# EAGLE schematic CSv2.1_exp_board (EAGLE 9.6.2)
COMPANY: ADAFRUIT INDUSTRIES; DRAWN: KTOWN; REV: B

## Sheet 1 of 2
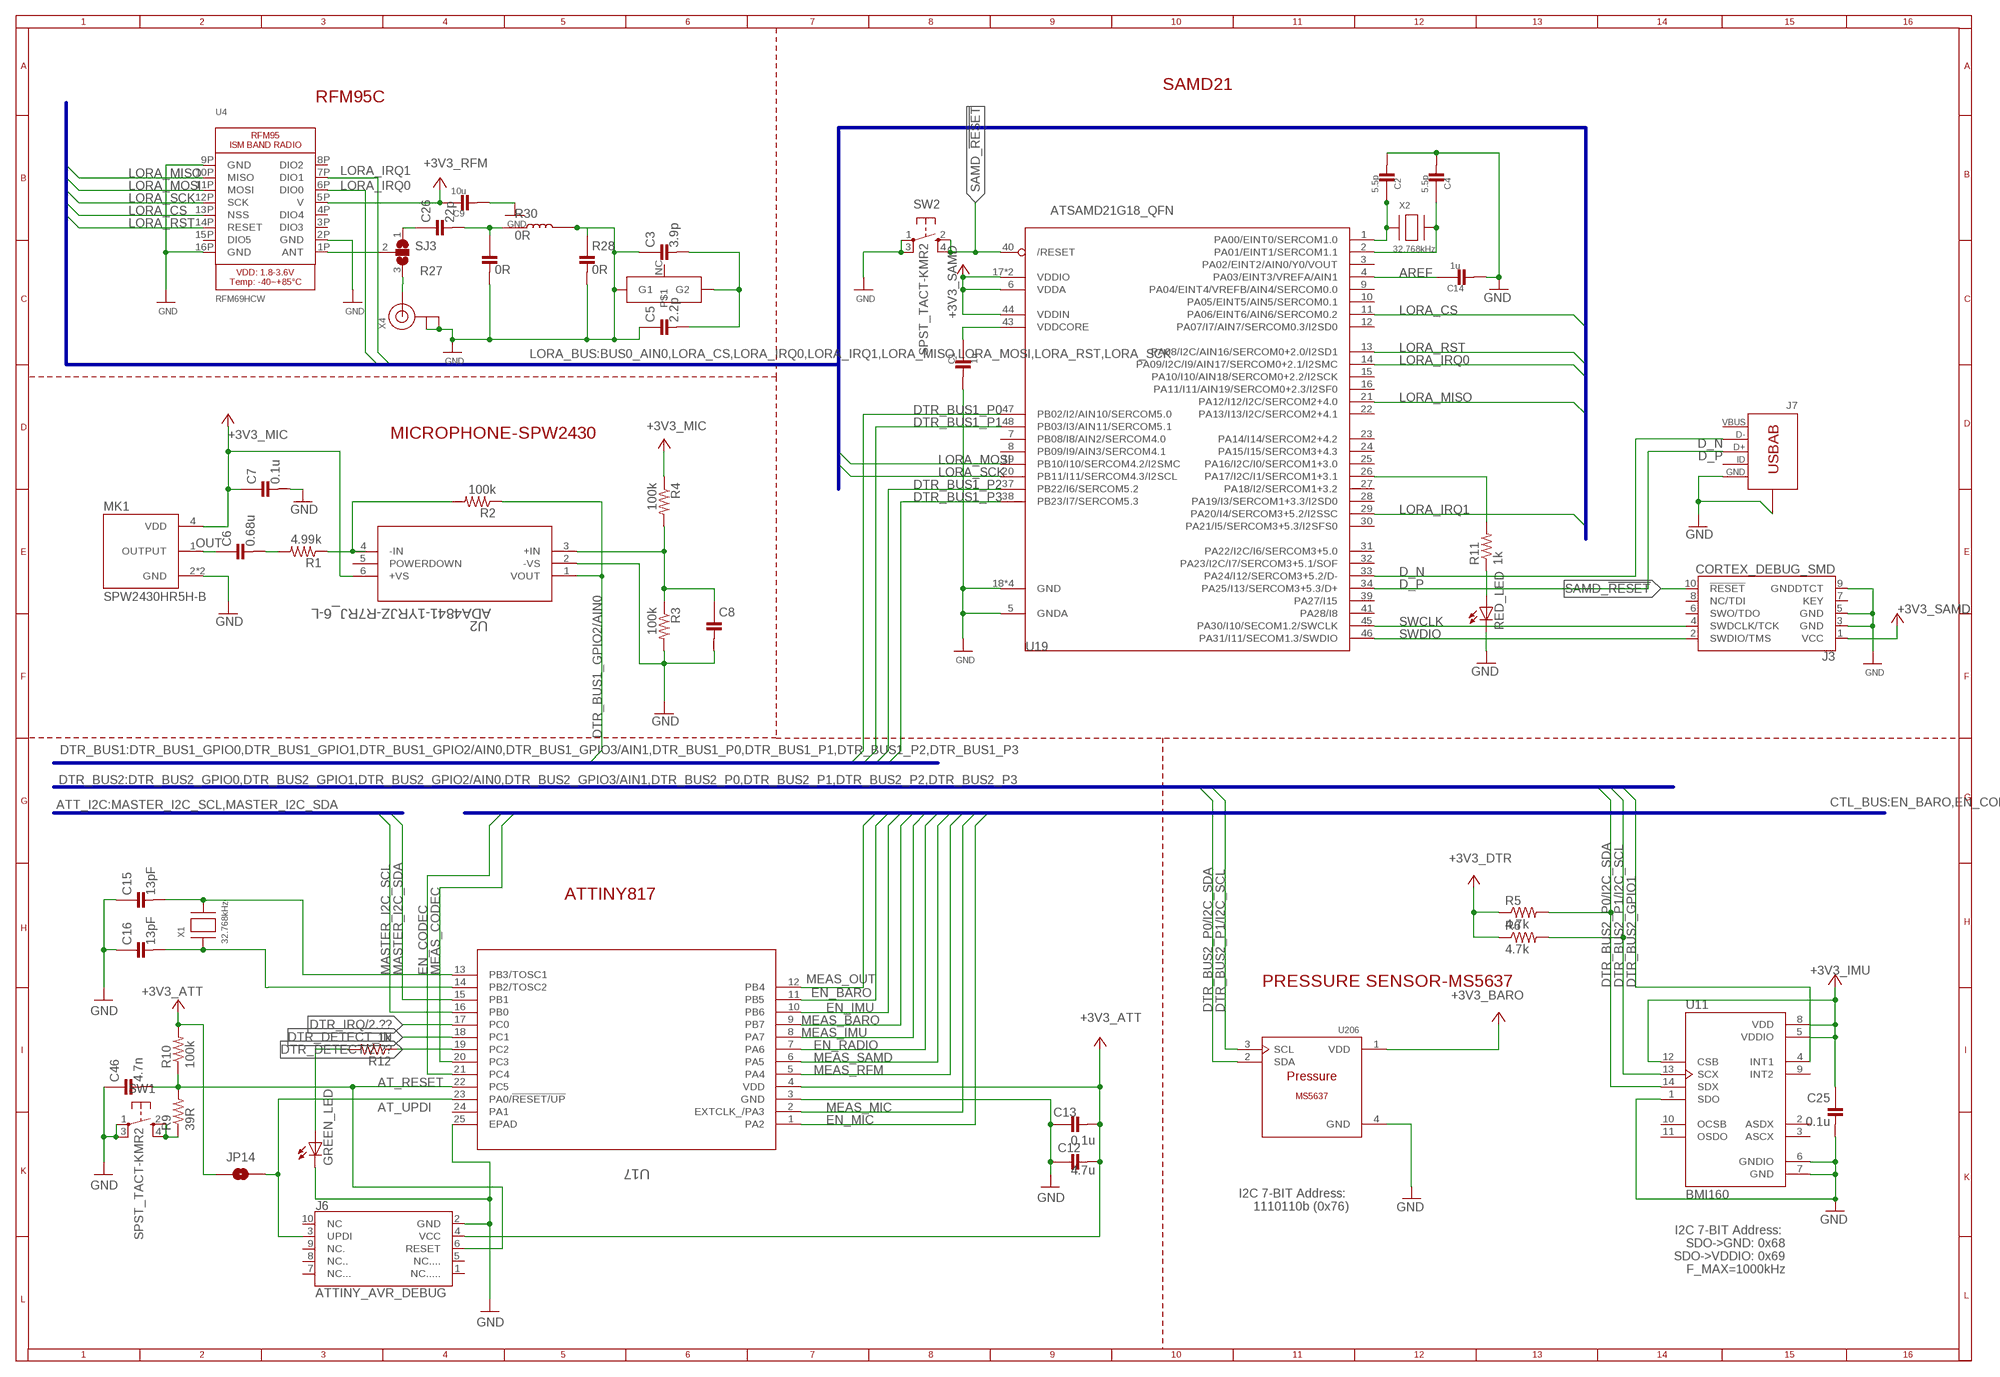
[diagram p0: schematic, sheet 1, part 1 of 2]
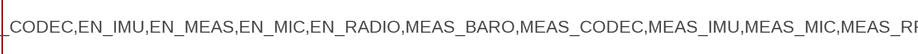
[diagram p1: schematic, sheet 1, part 2 of 2]

### Parts
A1  ILA09_CHIP_ANTENNA  [ILA_09_CHIP_ANTENNA]
C1  1u  C-0402  [C0402]
C2  5.5p  C-0402  [C0402]
C3  3.9p  C0402-ANT0402  [C0402-S]
C4  5.5p  C-0402  [C0402]
C5  2.2p  C0402-ANT0402  [C0402-S]
C6  0.68u  C-0402  [C0402]
C7  0.1u  C-0402  [C0402]
C8  1u  C-0402  [C0402]
C9  10u  C-0603  [C0603]
C12  4.7u  C-0603  [C0603]
C13  0.1u  C-0402  [C0402]
C14  1u  C-0402  [C0402]
C15  13pF  C-0402  [C0402]
C16  13pF  C-0402  [C0402]
C25  0.1u  C-0402  [C0402]
C26  22p  C0402-ANT0402  [C0402-S]
C46  4.7n  C-0402  [C0402]
GREEN_LED  LEDCHIPLED_0603  [CHIPLED_0603]
J3  CORTEX_DEBUG_SMD  [SAMTECH_FTSH-105-01]
J6  ATTINY_AVR_DEBUG  [SAMTECH_FTSH-105-01]
J7  J-USB-HIROSE-MICRO-USB  [USB-THRU-ZX62D-AB-5P8]
JP14  JUMPER-SMT_2_NO_PASTEFREE  [SMT-JUMPER_2_NO_PASTEFREE_NO-SILK]
MK1  SPW2430HR5H-B  [MIC_SPW2430HR5H-B]
R1  4.99k  R-0402  [R0402]
R2  100k  R-0402  [R0402]
R3  100k  R-0402  [R0402]
R4  100k  R-0402  [R0402]
R5  4.7k  R-0402  [R0402]
R6  4.7k  R-0402  [R0402]
R9  39R  R-0402  [R0402]
R10  100k  R-0402  [R0402]
R11  1k  R-0402  [R0402]
R12  1k  R-0402  [R0402]
R27  0R  C0402-ANT0402  [C0402-S]
R28  0R  C0402-ANT0402  [C0402-S]
R30  0R  L0402  [L0402]
RED_LED  LEDCHIPLED_0603  [CHIPLED_0603]
SJ3  JUMPER_SJ2W  [JUMPER_SJ_2]
SW1  SPST_TACT-KMR2  [KMR2]
SW2  SPST_TACT-KMR2  [KMR2]
U2  ADA4841-1YRJZ-R7RJ_6-L  [RJ_6-L]
U4  RFM69HCW  RFM95C  [RFM-MOD]
U11  BMI160  [PQFN50P300X250X88-14N]
U17  ATTINY817-MFRQFN24_RX4MC-L_ATTINY817-MFR  [ATTINY817-MFRQFN24_RX4MC-L_QFN24_4X4MC]
U19  ATSAMD21G18_QFN  MICROBUILDER_ATSAMD21J_QFN  [MICROBUILDER_TQFN48_7MM]
U206  MS5637  [MS5637]
X1  32.768kHz  ADAFRUIT2_XTAL-3.2X1.5  [ADAFRUIT2_XTAL3215]
X2  32.768kHz  ADAFRUIT2_XTAL-3.2X1.5  [ADAFRUIT2_XTAL3215]
X4  uFL  J-U.FL  [U.FL]

### Nets
+3V3_ATT [power]: C12.2 C13.2 J6.4(VCC) JP14.1 R10.2 U17.4(VDD) ; supply symbol labelled +3V3 ; also sheet 2
+3V3_BARO [power]: U206.1(VDD) ; supply symbol labelled +3V3 ; also sheet 2
+3V3_DTR [power]: R5.1 R6.1 ; supply symbol labelled +3V3 ; also sheet 2
+3V3_IMU [power]: C25.1 U11.5(VDDIO) U11.8(VDD) U11.12(CSB) ; supply symbol labelled +3V3 ; also sheet 2
+3V3_MIC [power]: C7.1 MK1.4(VDD) R4.1 U2.6(+VS) ; supply symbol labelled +3V3 ; also sheet 2
+3V3_RFM [power]: C9.1 U4.5P(V) ; supply symbol labelled +3V3 ; also sheet 2
+3V3_SAMD [power]: J3.1(VCC) U19.6(VDDA) U19.17(VDDIO) U19.36(VDDIO) U19.44(VDDIN) ; supply symbol labelled +3V3 ; also sheet 2
AREF: C14.1 U19.4(PA03/EINT3/VREFA/AIN1)
AT_RESET: C46.2 J6.6(RESET) R9.2 R10.1 U17.22(PC5)
AT_UPDI: J6.3(UPDI) JP14.2 U17.23(PA0/!RESET/UP)
D_N [diff_pair]: J7.D- U19.33(PA24/I12/SERCOM3+5.2/D-)
D_P [diff_pair]: J7.D+ U19.34(PA25/I13/SERCOM3+5.3/D+)
DTR_BUS1_GPIO2/AIN0: R2.1 U2.1(VOUT) ; also sheet 2
DTR_BUS1_P0: U19.47(PB02/I2/AIN10/SERCOM5.0) ; also sheet 2
DTR_BUS1_P1: U19.48(PB03/I3/AIN11/SERCOM5.1) ; also sheet 2
DTR_BUS1_P2: U19.37(PB22/I6/SERCOM5.2) ; also sheet 2
DTR_BUS1_P3: U19.38(PB23/I7/SERCOM5.3) ; also sheet 2
DTR_BUS2_GPIO1: U11.4(INT1) ; also sheet 2
DTR_BUS2_P0/I2C_SDA: R5.2 U11.14(SDX) U206.2(SDA) ; also sheet 2
DTR_BUS2_P1/I2C_SCL: R6.2 U11.13(SCX) U206.3(SCL) ; also sheet 2
DTR_DETECT: R12.1 U17.19(PC2) ; also sheet 2
DTR_DETECT_IN: U17.18(PC1)
DTR_DETECT_LED: GREEN_LED.A R12.2
DTR_IRQ: U17.17(PC0) ; also sheet 2
EN_BARO: U17.11(PB5) ; also sheet 2
EN_CODEC: U17.21(PC4) ; also sheet 2
EN_IMU: U17.10(PB6) ; also sheet 2
EN_MIC: U17.1(PA2) ; also sheet 2
EN_RADIO: U17.7(PA6) ; also sheet 2
GND: A1.G1 C1.2 C2.2 C3.1 C4.2 C5.1 C7.2 C8.2 C9.2 C12.1 C13.1 C14.2 C15.1 C16.1 C25.2 C46.1 GREEN_LED.C J3.3(GND) J3.5(GND) J3.9(GNDDTCT) J6.2(GND) J7.GND J7.S1(SHIELD) J7.S2(SHIELD) J7.S3(SHIELD) J7.S4(SHIELD) MK1.2(GND) MK1.3(GND) R3.2 R27.2 R28.1 R28.2 R30.2 RED_LED.C SW1.1(P) SW1.3(P1) SW2.1(P) SW2.3(P1) U2.2(-VS) U4.2P(GND) U4.9P(GND) U4.16P(GND) U11.1(SDO) U11.6(GNDIO) U11.7(GND) U17.3(GND) U17.25(EPAD) U19.5(GNDA) U19.18(GND) U19.35(GND) U19.42(GND) U19.THERMAL(GND) U206.4(GND) X4.1(GND) X4.2(GND) ; also sheet 2
IN-: R1.1 R2.2 U2.4(-IN)
LORA_CS: U4.13P(NSS) U19.11(PA06/EINT6/AIN6/SERCOM0.2)
LORA_IRQ0: U4.6P(DIO0) U19.14(PA09/I2C/I9/AIN17/SERCOM0+2.1/I2SMC)
LORA_IRQ1: U4.7P(DIO1) U19.29(PA20/I4/SERCOM3+5.2/I2SSC)
LORA_MISO: U4.10P(MISO) U19.21(PA12/I12/I2C/SERCOM2+4.0)
LORA_MOSI: U4.11P(MOSI) U19.19(PB10/I10/SERCOM4.2/I2SMC)
LORA_RST: U4.14P(RESET) U19.13(PA08/I2C/AIN16/SERCOM0+2.0/I2SD1)
LORA_SCK: U4.12P(SCK) U19.20(PB11/I11/SERCOM4.3/I2SCL)
MASTER_I2C_SCL: U17.16(PB0) ; also sheet 2
MASTER_I2C_SDA: U17.15(PB1) ; also sheet 2
MEAS_BARO: U17.9(PB7) ; also sheet 2
MEAS_CODEC: U17.20(PC3) ; also sheet 2
MEAS_IMU: U17.8(PA7) ; also sheet 2
MEAS_MIC: U17.2(EXTCLK_/PA3) ; also sheet 2
MEAS_OUT: U17.12(PB4) ; also sheet 2
MEAS_RFM: U17.5(PA4) ; also sheet 2
MEAS_SAMD: U17.6(PA5) ; also sheet 2
N$1: C1.1 U19.43(VDDCORE)
N$2: SJ3.3 X4.3(SIGNAL)
N$3: C8.1 R3.1 R4.2 U2.3(+IN)
N$4: A1.G2 C3.2 C5.2
N$5: C2.1 U19.1(PA00/EINT0/SERCOM1.0) X2.P$1
N$6: C6.2 R1.2
N$7: C4.1 U19.2(PA01/EINT1/SERCOM1.1) X2.P$2
N$9: C26.1 SJ3.1
N$12: R9.1 SW1.2(S) SW1.4(S1)
N$13: C26.2 R27.1 R30.1
N$19: R11.2 U19.26(PA17/I2C/I1/SERCOM1+3.1)
N$20: R11.1 RED_LED.A
N$22: C16.2 U17.14(PB2/TOSC2) X1.P$1
N$23: C15.2 U17.13(PB3/TOSC1) X1.P$2
N$26: SJ3.2 U4.1P(ANT)
OUT: C6.1 MK1.1(OUTPUT)
SAMD_!RESET: J3.10(!RESET) SW2.2(S) SW2.4(S1) U19.40(/RESET)
SWCLK: J3.4(SWDCLK/TCK) U19.45(PA30/I10/SECOM1.2/SWCLK)
SWDIO: J3.2(SWDIO/TMS) U19.46(PA31/I11/SECOM1.3/SWDIO)
Unconnected: A1.NC J3.6(SWO/TDO) J3.7(KEY) J3.8(NC/TDI) J6.1(NC.....) J6.5(NC....) J6.7(NC...) J6.8(NC..) J6.9(NC.) J6.10(NC) J7.USBID J7.VBUS U4.3P(DIO3) U4.4P(DIO4) U4.8P(DIO2) U4.15P(DIO5) U11.2(ASDX) U11.3(ASCX) U11.9(INT2) U11.10(OCSB) U11.11(OSDO) U17.24(PA1) U19.3(PA02/EINT2/AIN0/Y0/VOUT) U19.7(PB08/I8/AIN2/SERCOM4.0) U19.8(PB09/I9/AIN3/SERCOM4.1) U19.9(PA04/EINT4/VREFB/AIN4/SERCOM0.0) U19.10(PA05/EINT5/AIN5/SERCOM0.1) U19.12(PA07/I7/AIN7/SERCOM0.3/I2SD0) U19.15(PA10/I10/AIN18/SERCOM0+2.2/I2SCK) U19.16(PA11/I11/AIN19/SERCOM0+2.3/I2SF0) U19.22(PA13/I13/I2C/SERCOM2+4.1) U19.23(PA14/I14/SERCOM2+4.2) U19.24(PA15/I15/SERCOM3+4.3) U19.25(PA16/I2C/I0/SERCOM1+3.0) U19.27(PA18/I2/SERCOM1+3.2) U19.28(PA19/I3/SERCOM1+3.3/I2SD0) U19.30(PA21/I5/SERCOM3+5.3/I2SFS0) U19.31(PA22/I2C/I6/SERCOM3+5.0) U19.32(PA23/I2C/I7/SERCOM3+5.1/SOF) U19.39(PA27/I15) U19.41(PA28/I8)

### Buses
LORA_BUS:BUS0_AIN0,LORA_CS,LORA_IRQ0,LORA_IRQ1,LORA_MISO,LORA_MOSI,LORA_RST,LORA_SCK
ATT_I2C:MASTER_I2C_SCL,MASTER_I2C_SDA
CTL_BUS:EN_BARO,EN_CODEC,EN_IMU,EN_MEAS,EN_MIC,EN_RADIO,MEAS_BARO,MEAS_CODEC,MEAS_IMU,MEAS_MIC,MEAS_RFM,MEAS_SAMD
DTR_BUS1:DTR_BUS1_GPIO0,DTR_BUS1_GPIO1,DTR_BUS1_GPIO2/AIN0,DTR_BUS1_GPIO3/AIN1,DTR_BUS1_P0,DTR_BUS1_P1,DTR_BUS1_P2,DTR_BUS1_P3
DTR_BUS2:DTR_BUS2_GPIO0,DTR_BUS2_GPIO1,DTR_BUS2_GPIO2/AIN0,DTR_BUS2_GPIO3/AIN1,DTR_BUS2_P0,DTR_BUS2_P1,DTR_BUS2_P2,DTR_BUS2_P3

### Notes on the sheet
- SAMD21
- RFM95C
- MICROPHONE-SPW2430
- ATTINY817
- PRESSURE SENSOR-MS5637
- I2C 7-BIT Address: 
  1110110b (0x76)
- I2C 7-BIT Address: 
  SDO->GND: 0x68
  SDO->VDDIO: 0x69
  F_MAX=1000kHz

## Sheet 2 of 2
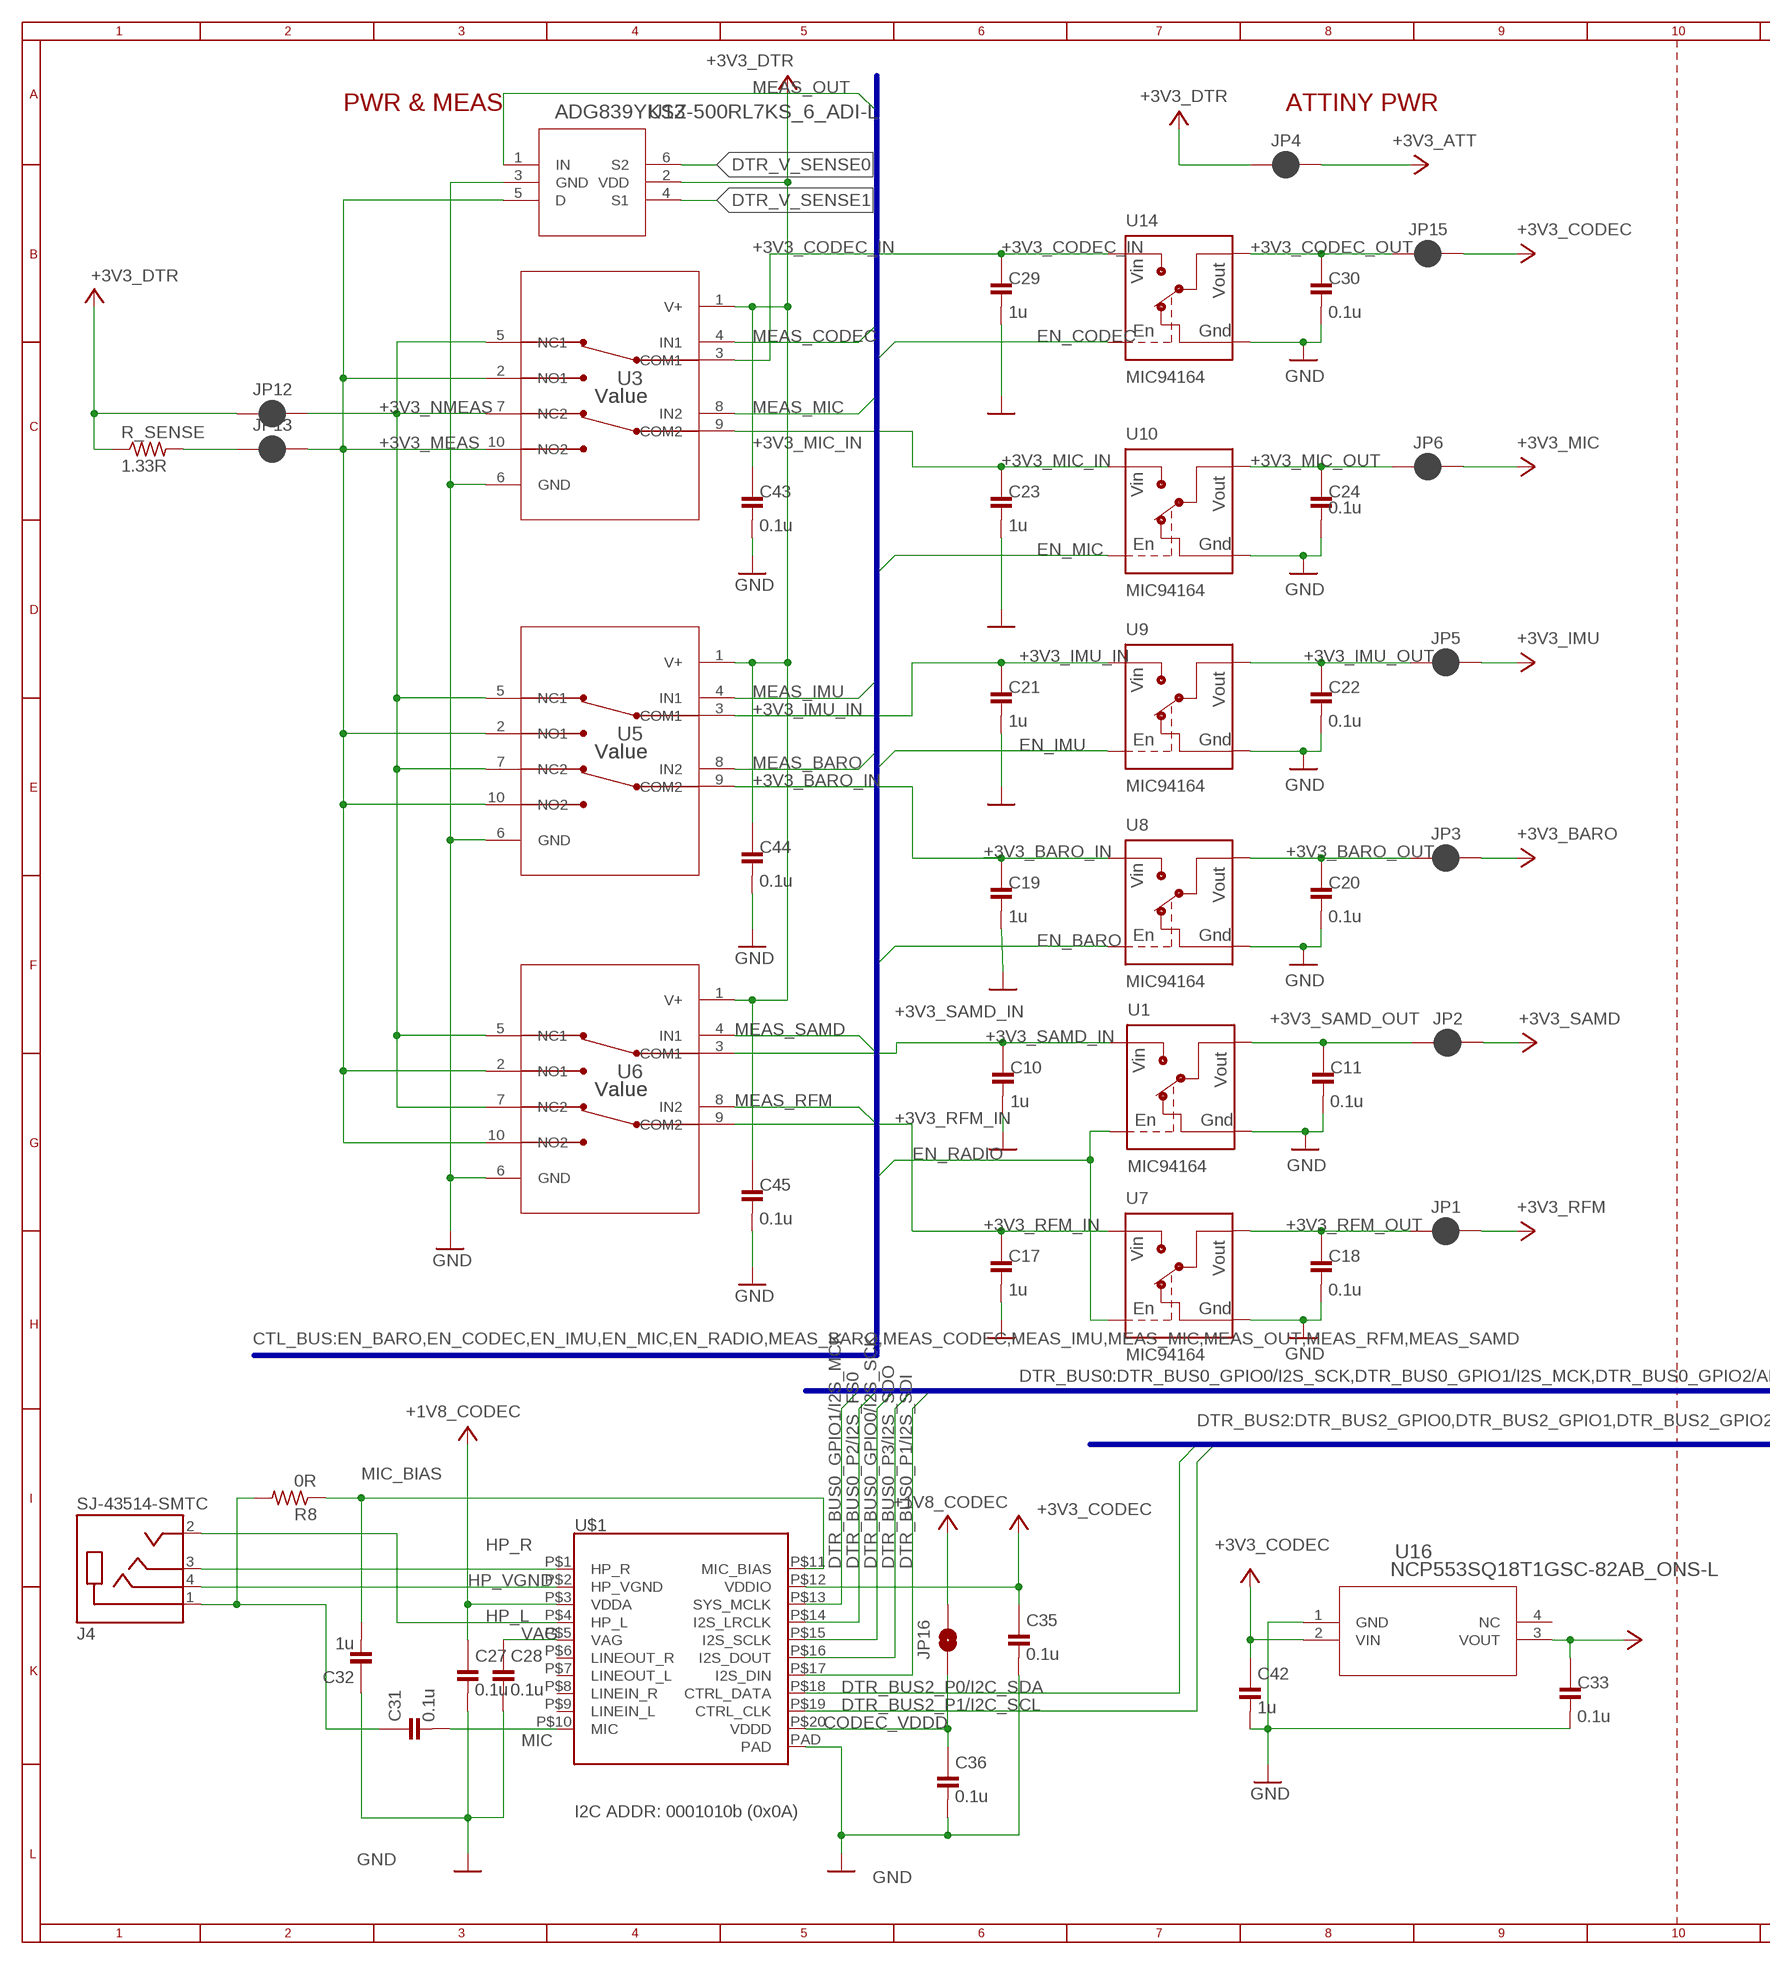
[diagram p2: schematic, sheet 2, part 1 of 2]
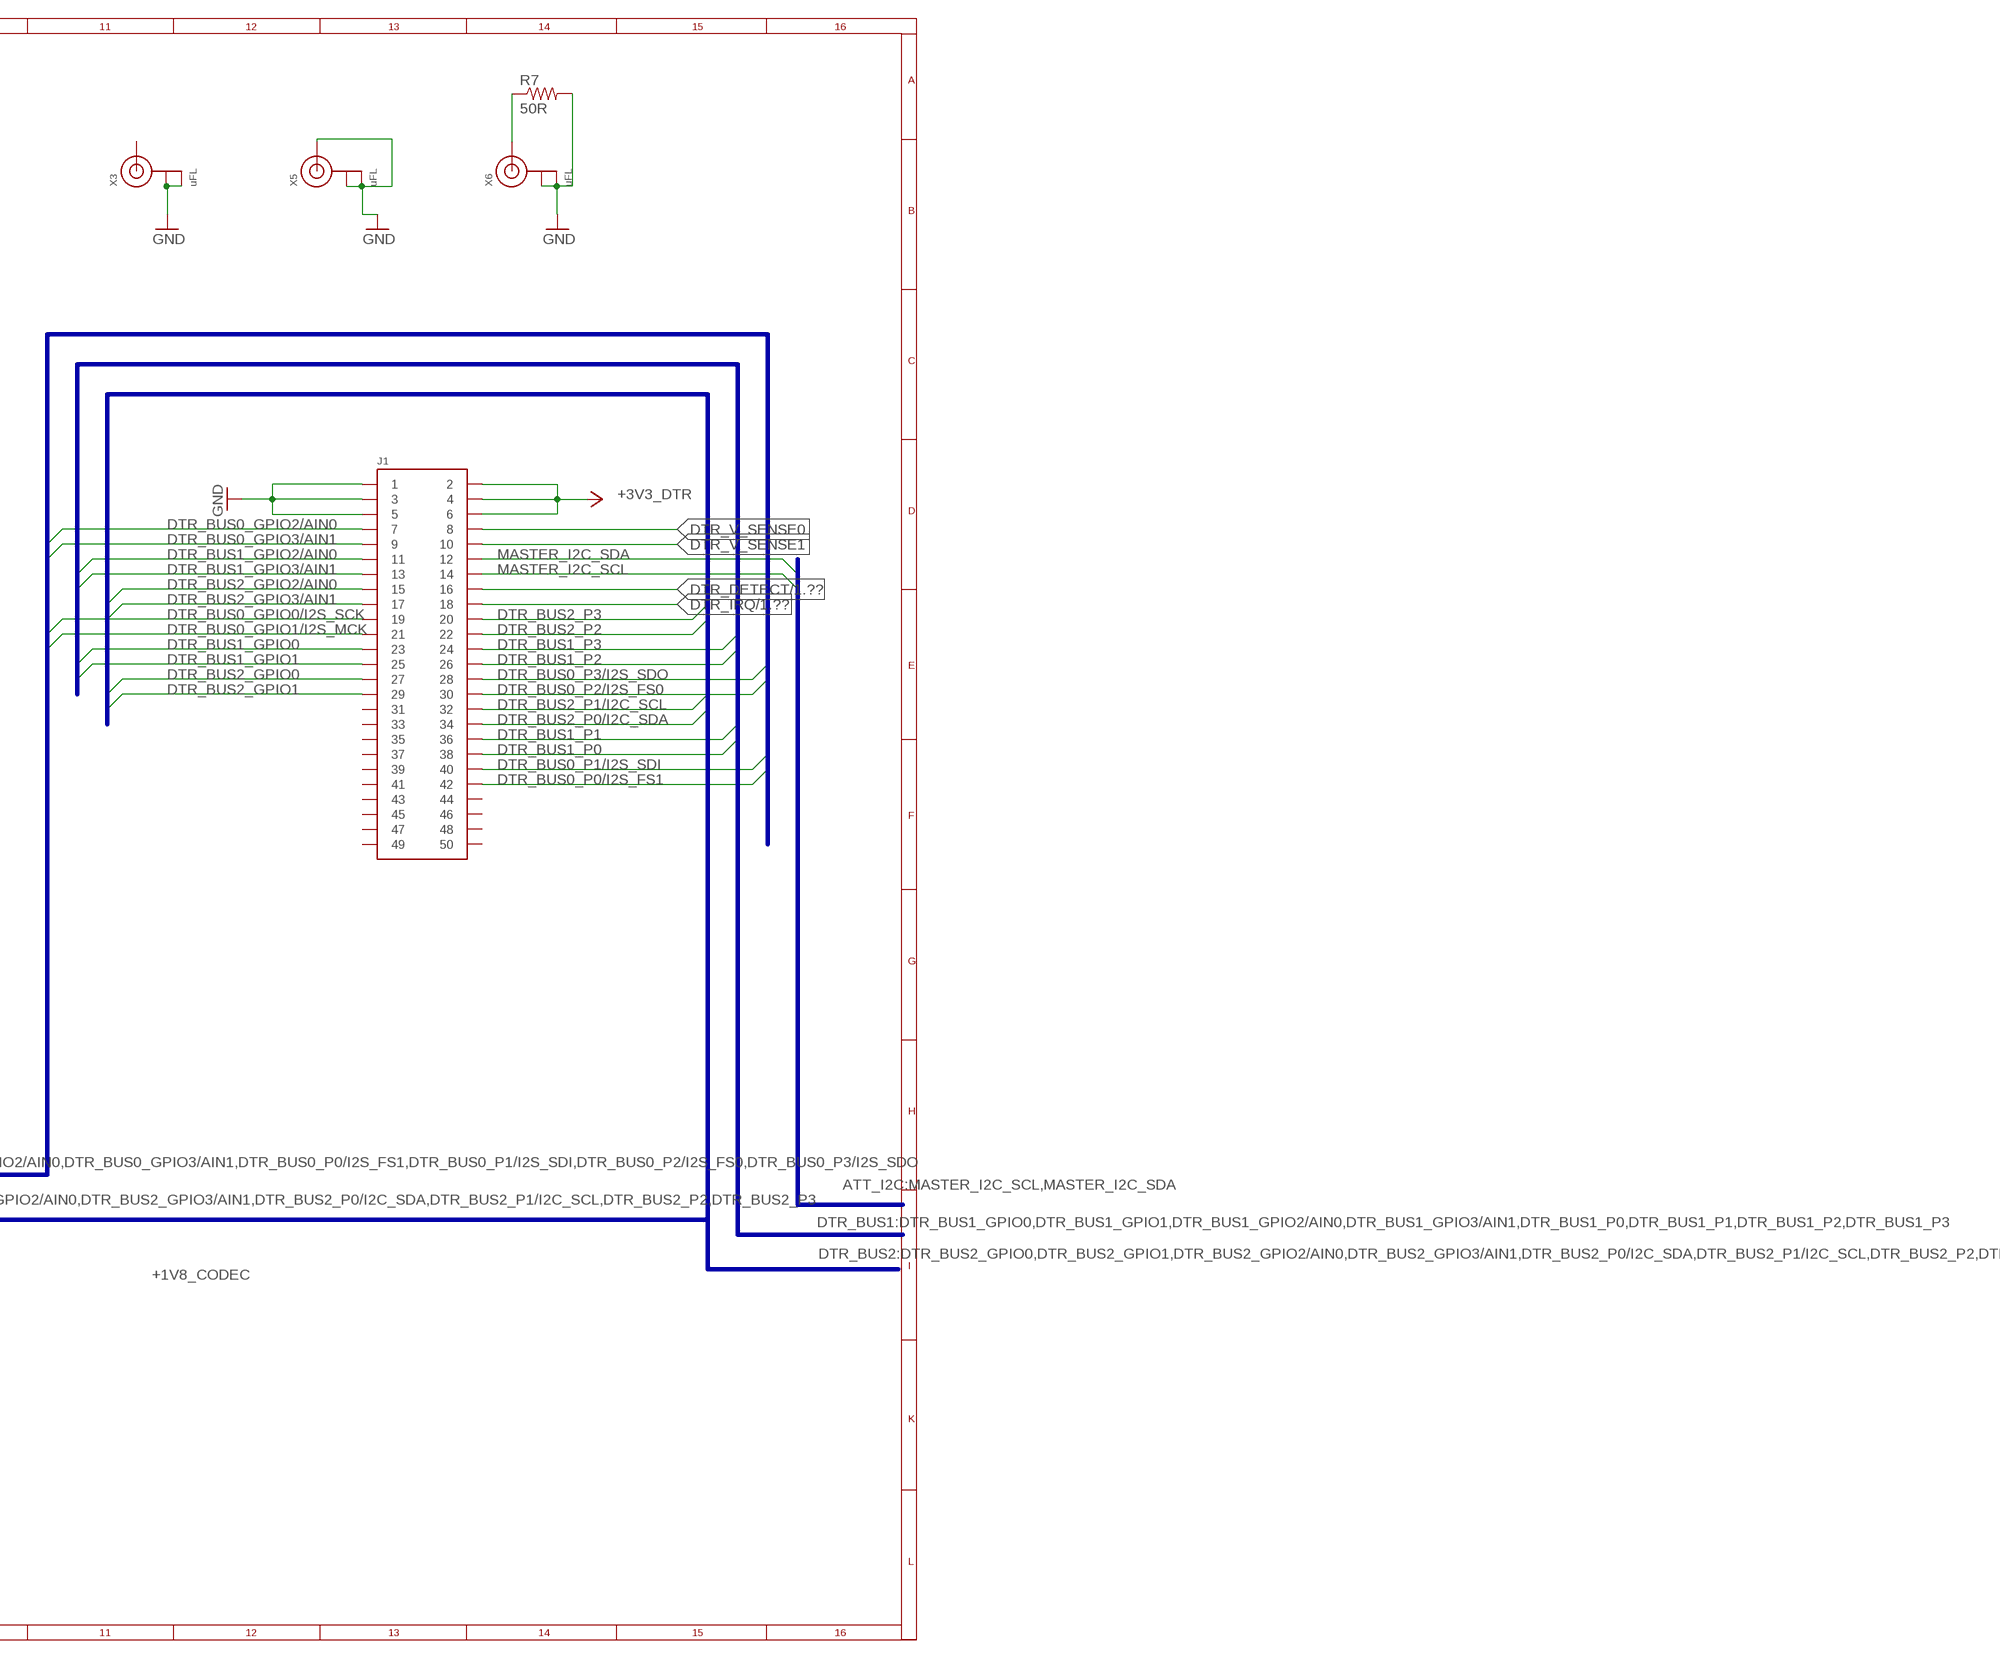
[diagram p3: schematic, sheet 2, part 2 of 2]

### Parts
C10  1u  C-0402  [C0402]
C11  0.1u  C-0402  [C0402]
C17  1u  C-0402  [C0402]
C18  0.1u  C-0402  [C0402]
C19  1u  C-0402  [C0402]
C20  0.1u  C-0402  [C0402]
C21  1u  C-0402  [C0402]
C22  0.1u  C-0402  [C0402]
C23  1u  C-0402  [C0402]
C24  0.1u  C-0402  [C0402]
C27  0.1u  C-0402  [C0402]
C28  0.1u  C-0402  [C0402]
C29  1u  C-0402  [C0402]
C30  0.1u  C-0402  [C0402]
C31  0.1u  C-0402  [C0402]
C32  1u  C-0402  [C0402]
C33  0.1u  C-0402  [C0402]
C35  0.1u  C-0402  [C0402]
C36  0.1u  C-0402  [C0402]
C42  1u  C-0402  [C0402]
C43  0.1u  C-0402  [C0402]
C44  0.1u  C-0402  [C0402]
C45  0.1u  C-0402  [C0402]
J1  HIROSE-DF40_50-PIN_CONNECTORS-HEADER  [HRS_DF40C-50DP-0.4V(51)]
J4  SJ-43514-SMTC  [CUI_SJ-43514-SMT-TEMP]
JP1  JUMPER-SMT_2_NC_PASTELG_NO-SILK  [SMT-JUMPER_2_NC_PASTE_NO-SILK]
JP2  JUMPER-SMT_2_NC_PASTELG_NO-SILK  [SMT-JUMPER_2_NC_PASTE_NO-SILK]
JP3  JUMPER-SMT_2_NC_PASTELG_NO-SILK  [SMT-JUMPER_2_NC_PASTE_NO-SILK]
JP4  JUMPER-SMT_2_NC_PASTELG_NO-SILK  [SMT-JUMPER_2_NC_PASTE_NO-SILK]
JP5  JUMPER-SMT_2_NC_PASTELG_NO-SILK  [SMT-JUMPER_2_NC_PASTE_NO-SILK]
JP6  JUMPER-SMT_2_NC_PASTELG_NO-SILK  [SMT-JUMPER_2_NC_PASTE_NO-SILK]
JP12  JUMPER-SMT_2_NC_PASTELG_NO-SILK  [SMT-JUMPER_2_NC_PASTE_NO-SILK]
JP13  JUMPER-SMT_2_NC_PASTELG_NO-SILK  [SMT-JUMPER_2_NC_PASTE_NO-SILK]
JP15  JUMPER-SMT_2_NC_PASTELG_NO-SILK  [SMT-JUMPER_2_NC_PASTE_NO-SILK]
JP16  JUMPER-SMT_2_NO_PASTEFREE  [SMT-JUMPER_2_NO_PASTEFREE_NO-SILK]
R7  50R  R-0402  [R0402]
R8  0R  R-0402  [R0402]
R_SENSE  1.33R  R-0402  [R0402]
U1  LOADSWITCH-MIC94164  [WLCSP6_2X3]
U3  Value  TS3A24159DGSRDGS0010A_L  [DGS0010A_L]
U5  Value  TS3A24159DGSRDGS0010A_L  [DGS0010A_L]
U6  Value  TS3A24159DGSRDGS0010A_L  [DGS0010A_L]
U7  LOADSWITCH-MIC94164  [WLCSP6_2X3]
U8  LOADSWITCH-MIC94164  [WLCSP6_2X3]
U9  LOADSWITCH-MIC94164  [WLCSP6_2X3]
U10  LOADSWITCH-MIC94164  [WLCSP6_2X3]
U13  ADG839YKSZ-500RL7KS_6_ADI-L  [KS_6_ADI-L]
U14  LOADSWITCH-MIC94164  [WLCSP6_2X3]
U16  NCP553SQ18T1GSC-82AB_ONS-L  [SC-82AB_ONS-L]
U$1  SGTL5000-QFN20  [SGTL5000-QFN20]
X3  uFL  J-U.FL  [U.FL]
X5  uFL  J-U.FL  [U.FL]
X6  uFL  J-U.FL  [U.FL]

### Nets
+1V8_CODEC: C27.1 C33.1 JP16.2 U16.3(VOUT) U$1.P$3(VDDA) ; supply symbol labelled +3V3
+3V3_ATT [power]: JP4.2 ; supply symbol labelled +3V3 ; also sheet 1
+3V3_BARO [power]: JP3.2 ; supply symbol labelled +3V3 ; also sheet 1
+3V3_BARO_IN [power]: C19.1 U5.9(COM2) U8.A2(VIN) U8.B2(VIN)
+3V3_BARO_OUT [power]: C20.1 JP3.1 U8.A1(VOUT) U8.B1(VOUT)
+3V3_CODEC [power]: C35.1 C42.1 JP15.2 U16.2(VIN) U$1.P$12(VDDIO) ; supply symbol labelled +3V3
+3V3_CODEC_IN [power]: C29.1 U3.3(COM1) U14.A2(VIN) U14.B2(VIN)
+3V3_CODEC_OUT [power]: C30.1 JP15.1 U14.A1(VOUT) U14.B1(VOUT)
+3V3_DTR [power]: C43.1 C44.1 C45.1 J1.2 J1.4 J1.6 JP4.1 JP12.1 R_SENSE.1 U3.1(V+) U5.1(V+) U6.1(V+) U13.2(VDD) ; supply symbol labelled +3V3 ; also sheet 1
+3V3_IMU [power]: JP5.2 ; supply symbol labelled +3V3 ; also sheet 1
+3V3_IMU_IN [power]: C21.1 U5.3(COM1) U9.A2(VIN) U9.B2(VIN)
+3V3_IMU_OUT [power]: C22.1 JP5.1 U9.A1(VOUT) U9.B1(VOUT)
+3V3_MEAS [power]: JP13.2 U3.2(NO1) U3.10(NO2) U5.2(NO1) U5.10(NO2) U6.2(NO1) U6.10(NO2) U13.5(D)
+3V3_MIC [power]: JP6.2 ; supply symbol labelled +3V3 ; also sheet 1
+3V3_MIC_IN [power]: C23.1 U3.9(COM2) U10.A2(VIN) U10.B2(VIN)
+3V3_MIC_OUT [power]: C24.1 JP6.1 U10.A1(VOUT) U10.B1(VOUT)
+3V3_NMEAS [power]: JP12.2 U3.5(NC1) U3.7(NC2) U5.5(NC1) U5.7(NC2) U6.5(NC1) U6.7(NC2)
+3V3_RFM [power]: JP1.2 ; supply symbol labelled +3V3 ; also sheet 1
+3V3_RFM_IN [power]: C17.1 U6.9(COM2) U7.A2(VIN) U7.B2(VIN)
+3V3_RFM_OUT [power]: C18.1 JP1.1 U7.A1(VOUT) U7.B1(VOUT)
+3V3_SAMD [power]: JP2.2 ; supply symbol labelled +3V3 ; also sheet 1
+3V3_SAMD_IN [power]: C10.1 U1.A2(VIN) U1.B2(VIN) U6.3(COM1)
+3V3_SAMD_OUT [power]: C11.1 JP2.1 U1.A1(VOUT) U1.B1(VOUT)
CODEC_VDDD: C36.1 JP16.1 U$1.P$20(VDDD)
DTR_BUS0_GPIO0/I2S_SCK: J1.19 U$1.P$15(I2S_SCLK)
DTR_BUS0_GPIO1/I2S_MCK: J1.21 U$1.P$13(SYS_MCLK)
DTR_BUS0_GPIO2/AIN0: J1.7
DTR_BUS0_GPIO3/AIN1: J1.9
DTR_BUS0_P0/I2S_FS1: J1.42
DTR_BUS0_P1/I2S_SDI: J1.40 U$1.P$17(I2S_DIN)
DTR_BUS0_P2/I2S_FS0: J1.30 U$1.P$14(I2S_LRCLK)
DTR_BUS0_P3/I2S_SDO: J1.28 U$1.P$16(I2S_DOUT)
DTR_BUS1_GPIO0: J1.23
DTR_BUS1_GPIO1: J1.25
DTR_BUS1_GPIO2/AIN0: J1.11 ; also sheet 1
DTR_BUS1_GPIO3/AIN1: J1.13
DTR_BUS1_P0: J1.38 ; also sheet 1
DTR_BUS1_P1: J1.36 ; also sheet 1
DTR_BUS1_P2: J1.26 ; also sheet 1
DTR_BUS1_P3: J1.24 ; also sheet 1
DTR_BUS2_GPIO0: J1.27
DTR_BUS2_GPIO1: J1.29 ; also sheet 1
DTR_BUS2_GPIO2/AIN0: J1.15
DTR_BUS2_GPIO3/AIN1: J1.17
DTR_BUS2_P0/I2C_SDA: J1.34 U$1.P$18(CTRL_DATA) ; also sheet 1
DTR_BUS2_P1/I2C_SCL: J1.32 U$1.P$19(CTRL_CLK) ; also sheet 1
DTR_BUS2_P2: J1.22
DTR_BUS2_P3: J1.20
DTR_DETECT: J1.16 ; also sheet 1
DTR_IRQ: J1.18 ; also sheet 1
DTR_V_SENSE0: J1.8 U13.6(S2)
DTR_V_SENSE1: J1.10 U13.4(S1)
EN_BARO: U8.C2(ENABLE) ; also sheet 1
EN_CODEC: U14.C2(ENABLE) ; also sheet 1
EN_IMU: U9.C2(ENABLE) ; also sheet 1
EN_MIC: U10.C2(ENABLE) ; also sheet 1
EN_RADIO: U1.C2(ENABLE) U7.C2(ENABLE) ; also sheet 1
GND: C10.2 C11.2 C17.2 C18.2 C19.2 C20.2 C21.2 C22.2 C23.2 C24.2 C27.2 C28.2 C29.2 C30.2 C32.1 C33.2 C35.2 C36.2 C42.2 C43.2 C44.2 C45.2 J1.1 J1.3 J1.5 R7.2 U1.C1(GND) U3.6(GND) U5.6(GND) U6.6(GND) U7.C1(GND) U8.C1(GND) U9.C1(GND) U10.C1(GND) U13.3(GND) U14.C1(GND) U16.1(GND) U$1.PAD X3.1(GND) X3.2(GND) X5.1(GND) X5.2(GND) X5.3(SIGNAL) X6.1(GND) X6.2(GND) ; also sheet 1
HP_L: J4.2(TIP) U$1.P$4(HP_L)
HP_R: J4.3(RING1) U$1.P$1(HP_R)
HP_VGND: J4.4(RING2) U$1.P$2(HP_VGND)
MASTER_I2C_SCL: J1.14 ; also sheet 1
MASTER_I2C_SDA: J1.12 ; also sheet 1
MEAS_BARO: U5.8(IN2) ; also sheet 1
MEAS_CODEC: U3.4(IN1) ; also sheet 1
MEAS_IMU: U5.4(IN1) ; also sheet 1
MEAS_MIC: U3.8(IN2) ; also sheet 1
MEAS_OUT: U13.1(IN) ; also sheet 1
MEAS_RFM: U6.8(IN2) ; also sheet 1
MEAS_SAMD: U6.4(IN1) ; also sheet 1
MIC: C31.2 U$1.P$10(MIC)
MIC_BIAS: C32.2 R8.1 U$1.P$11(MIC_BIAS)
N$8: JP13.1 R_SENSE.2
N$11: R7.1 X6.3(SIGNAL)
N$25: C31.1 J4.1(SLEEVE) R8.2
VAG: C28.1 U$1.P$5(VAG)
Unconnected: J1.31 J1.33 J1.35 J1.37 J1.39 J1.41 J1.43 J1.44 J1.45 J1.46 J1.47 J1.48 J1.49 J1.50 U16.4(NC) U$1.P$6(LINEOUT_R) U$1.P$7(LINEOUT_L) U$1.P$8(LINEIN_R) U$1.P$9(LINEIN_L) X3.3(SIGNAL)

### Buses
ATT_I2C:MASTER_I2C_SCL,MASTER_I2C_SDA
DTR_BUS0:DTR_BUS0_GPIO0/I2S_SCK,DTR_BUS0_GPIO1/I2S_MCK,DTR_BUS0_GPIO2/AIN0,DTR_BUS0_GPIO3/AIN1,DTR_BUS0_P0/I2S_FS1,DTR_BUS0_P1/I2S_SDI,DTR_BUS0_P2/I2S_FS0,DTR_BUS0_P3/I2S_SDO
CTL_BUS:EN_BARO,EN_CODEC,EN_IMU,EN_MIC,EN_RADIO,MEAS_BARO,MEAS_CODEC,MEAS_IMU,MEAS_MIC,MEAS_OUT,MEAS_RFM,MEAS_SAMD
DTR_BUS1:DTR_BUS1_GPIO0,DTR_BUS1_GPIO1,DTR_BUS1_GPIO2/AIN0,DTR_BUS1_GPIO3/AIN1,DTR_BUS1_P0,DTR_BUS1_P1,DTR_BUS1_P2,DTR_BUS1_P3
DTR_BUS2:DTR_BUS2_GPIO0,DTR_BUS2_GPIO1,DTR_BUS2_GPIO2/AIN0,DTR_BUS2_GPIO3/AIN1,DTR_BUS2_P0/I2C_SDA,DTR_BUS2_P1/I2C_SCL,DTR_BUS2_P2,DTR_BUS2_P3

### Notes on the sheet
- PWR & MEAS | ATTINY PWR
- I2C ADDR: 0001010b (0x0A)

## Power pins joined to a net without a drawn wire
POWERDOWN: U2.5(POWERDOWN)

## Library data of the parts
A1 = CommonSense-DTR-v1:ILA09_CHIP_ANTENNA; DESC: RF ANT 915MHZ CHIP SOLDER SMD; MANUFACTURER: Taoglas; MPN: ILA.09; PARTNO: ILA.09; TYPE: Chip Antenna; Z-HEIGHT: 0.5mm
C1 C8 C14 = Capacitors:C-: Capacitor, Surface Mount; DESC: CAP CER 1UF 10V X5R 0402; MANUFACTURER: Kemet; MPN: C0402C105M8PACTU; PARTNO: C0402C105M8PACTU; SIZE: 0402; TC: X5R; TOL: 20%; TYPE: Capacitor; VOLT: 10V; VOLTAGE: 10V; Z-HEIGHT: 0.55mm
C2 C4 = Capacitors:C-: Capacitor, Surface Mount; DESC: CAP CER RF 5.5PF 50V +/-0.1 PF C; MANUFACTURER: Kemet; MPN: CBR04C559B5GAC; PARTNO: CBR04C559B5GAC; SIZE: 0402; TC: C0G, NP0; TOL: 0.1pF; TYPE: Capacitor; VOLT: 50V; VOLTAGE: 50V; Z-HEIGHT: 0.55mm
C3 = CommonSense-DTR-v1:C0402-ANT: Capacitor, Surface Mount; DESC: CAP CER 3.9PF 50V C0G/NP0 0402; MANUFACTURER: Murata; MPN: GJM1555C1H3R9WB01D; PARTNO: GJM1555C1H3R9WB01D; SIZE: 0402; TC: C0G, NP0; TOL: 0.05pF; TYPE: Capacitor; VOLT: 50V; VOLTAGE: 50V; Z-HEIGHT: 0.55mm
C5 = CommonSense-DTR-v1:C0402-ANT: Capacitor, Surface Mount; DESC: CAP CER 2.2PF 50V C0G/NP0 0402; HEIGHT: 0.55mm; MANUFACTURER: Murata; MPN: GJM1555C1H2R2WB01D; PARTNO: GJM1555C1H2R2WB01D; SIZE: 0402; TC: C0G, NP0; TOL: 0.05pF; TYPE: Capacitor; VOLT: 50V; VOLTAGE: 50V
C6 = Capacitors:C-: Capacitor, Surface Mount; DESC: CAP CER 0.68UF 6.3V X5R 0402; HEIGHT: 0.55mm; MANUFACTURER: Yageo; MPN: CC0402KRX5R5BB684; PARTNO: CC0402KRX5R5BB684; SIZE: 0402; TC: X5R; TOL: 10%; TYPE: Capacitor; VOLT: 6.3V; VOLTAGE: 6.3V
C7 C13 C25 = Capacitors:C-: Capacitor, Surface Mount; DESC: CAP CER 0.1UF 16V X7R 0402; HEIGHT: 0.55mm; MANUFACTURER: Kemet; MPN: C0402C104K4RACTU; PARTNO: C0402C104K4RACTU; SIZE: 0402; TC: X7R; TOL: 10%; TYPE: Capacitor; VOLT: 16V; VOLTAGE: 16V
C9 = Capacitors:C-: Capacitor, Surface Mount; DESC: CAP CER 10UF 6.3V X5R 0603; HEIGHT: 0.9mm; MANUFACTURER: Murata; MPN: GRM188R60J106KE47D; PARTNO: GRM188R60J106KE47D; SIZE: 0603; TC: X5R; TOL: 10%; TYPE: Capacitor; VOLT: 6.3V; VOLTAGE: 6.3V
C10 C17 C19 C21 C23 C29 = Capacitors:C-: Capacitor, Surface Mount; DESC: CAP CER 1UF 6.3V X5R 0402; HEIGHT: 0.55mm; MANUFACTURER: Yageo; MPN: CC0402KRX5R5BB105; PARTNO: CC0402KRX5R5BB105; SIZE: 0402; TC: X5R; TOL: 10%; TYPE: Capacitor; VOLT: 6.3V; VOLTAGE: 6.3V
C11 C18 C20 C22 C30 C33 C43-C45 = Capacitors:C-: Capacitor, Surface Mount; DESC: CAP CER 0.1UF 10V X7R 0402; DESCRIPTION: 0.1µF ±10% 10V Ceramic Capacitor X7R 0402 (1005 Metric); HEIGHT: 0.55mm; MANUFACTURER: Yageo; MPN: CC0402KRX7R6BB104; PARTNO: CC0402KRX7R6BB104; SIZE: 0402; TC: X7R; TOL: 10%; TYPE: Capacitor; VOLT: 10V; VOLTAGE: 6.3V
C12 = Capacitors:C-: Capacitor, Surface Mount; DESC: CAP CER 4.7UF 10V X5R 0603; HEIGHT: 0.9mm; MANUFACTURER: Kemet; MPN: C0603C475K8PACTU; PARTNO: C0603C475K8PACTU; SIZE: 0603; TC: X5R; TOL: 10%; TYPE: Capacitor; VOLT: 10V; VOLTAGE: 10V
C15 C16 = Capacitors:C-: Capacitor, Surface Mount; BOM: EXCLUDE; MANUFACTURER: Kemet; PARTNO: *; TC: X7R; TYPE: Capacitor; VOLTAGE: 6.3V
C24 = Capacitors:C-: Capacitor, Surface Mount; DESC: CAP CER 0.1UF 10V X7R 0402; HEIGHT: 0.55mm; MANUFACTURER: Yageo; MPN: CC0402KRX7R6BB104; PARTNO: CC0402KRX7R6BB104; SIZE: 0402; TC: X7R; TOL: 10%; TYPE: Capacitor; VOLT: 10V; VOLTAGE: 6.3V
C26 = CommonSense-DTR-v1:C0402-ANT: Capacitor, Surface Mount; BOM: EXCLUDE; DESC: CAP CER 22PF 50V C0G/NP0 0402; HEIGHT: 0.55mm; MANUFACTURER: Kemet; MPN: CBR04C220F5GAC; PARTNO: CBR04C220F5GAC; SIZE: 0402; TC: X7R; TOL: 1%; TYPE: Capacitor; VOLT: 50V; VOLTAGE: 50V
C27 C28 C31 C35 C36 = Capacitors:C-: Capacitor, Surface Mount; DESC: CAP CER 0.1UF 10V X7R 0402; MANUFACTURER: Kemet; MPN: CC0402KRX7R6BB104; PARTNO: CC0402KRX7R6BB104; TC: X7R; TOL: 10%; VOLTAGE: 6.3V
C32 = Capacitors:C-: Capacitor, Surface Mount; DESC: CAP CER 1UF 10V X7S 0402; MANUFACTURER: TDK; MPN: C1005X7S1A105K050BC; PARTNO: C1005X7S1A105K050BC; TC: X7R; TOL: 10%; VOLTAGE: 6.3V
C42 = Capacitors:C-: Capacitor, Surface Mount; DESC: CAP CER 1UF 10V X7S 0402; HEIGHT: 0.55mm; MANUFACTURER: TDK; MPN: C1005X7S1A105K050BC; PARTNO: C1005X7S1A105K050BC; SIZE: 0402; TC: X7S; TOL: 10%; TYPE: Capacitor; VOLT: 10V; VOLTAGE: 10V
C46 = Capacitors:C-: Capacitor, Surface Mount; DESC: CAP CER 4700PF 25V X7R 0402; HEIGHT: 0.55mm; MANUFACTURER: Kemet; MPN: C0402C472K3RACTU; PARTNO: C0402C472K3RACTU; SIZE: 0402; TC: X7R; TOL: 10%; TYPE: Capacitor; VOLT: 25; VOLTAGE: 25V
GREEN_LED = Diodes:LED: LED OSRAM: - CHIPLED LG R971, LG N971, LY N971, LG Q971, LY Q971, LO R971, LY R971 LH N974, LH R974 LS Q976, LO Q976, LY Q976 LO Q996 - Hyper CHIPLED LW Q18S LB Q993, LB Q99A, LB R99A - SideLED LS A670, LO A670, LY A670, LG A670, LP A670 LB A673, LV A673, LT A673, LW A673 LH A674 LY A675 LS A676, LA A676, LO A676, LY A676, LW A676 LS A679, LY A679, LG A679 - Hyper Micro SIDELED® LS Y876, LA Y876, LO Y876, LY Y876 LT Y87S - SmartLED LW L88C, LW L88S LB L89C, LB L89S, LG L890 LS L89K, LO L89K, LY L89K LS L896, LA L896, LO L896, LY L896 - TOPLED LS T670, LO T670, LY T670, LG T670, LP T670 LSG T670, LSP T670, LSY T670, LOP T670, LYG T670 LG T671, LOG T671, LSG T671 LB T673, LV T673, LT T673, LW T673 LH T674 LS T676, LA T676, LO T676, LY T676, LB T676, LH T676, LSB T676, LW T676 LB T67C, LV T67C, LT T67C, LS T67K, LO T67K, LY T67K, LW E67C LS E67B, LA E67B, LO E67B, LY E67B, LB E67C, LV E67C, LT E67C LW T67C LS T679, LY T679, LG T679 LS T770, LO T770, LY T770, LG T770, LP T770 LB T773, LV T773, LT T773, LW T773 LH T774 LS E675, LA E675, LY E675, LS T675 LS T776, LA T776, LO T776, LY T776, LB T776 LHGB T686 LT T68C, LB T68C - Hyper Mini TOPLED® LB M676 - Mini TOPLED Santana® LG M470 LS M47K, LO M47K, LY M47K Source: http://www.osram.convergy.de/; DESC: LED GREEN CLEAR CHIP SMD; MANUFACTURER: Kingbright; MPN: APT1608SGC; PARTNO: APT1608SGC; TYPE: LED
J1 = Connectors:HIROSE-DF40_50-PIN_CONNECTORS: Hirose DF40 series 50-pin mezzanine type connectors at 0.4mm pitch. Specification and Variants: https://www.hirose.com/product/document?clcode=&productname=&series=DF40&documenttype=Catalog&lang=en&documentid=D31649_en; MANUFACTURER: Hirose; MPN: DF40C-50DP-0.4V(51); PARTNO: DF40C-50DP-0.4V(51)
J3 = Debuggers:CORTEX_DEBUG: Cortex Debug Connector - 10 pin Supports JTAG debug, Serial Wire debug, and Serial Wire Viewer. PTH and SMD connector options available. General Connector Information <http://infocenter.arm.com/help/topic/com.arm.doc.faqs/attached/13634/cortex_debug_connectors.pdf> Products: PTH Connector <http://www.digikey.com/product-detail/en/cnc-tech/3220-10-0100-00/1175-1627-ND/3883661> -via Digi-Key SparkFun PSoc <https://www.sparkfun.com/products/13229> SparkFun T <https://www.sparkfun.com/products/13810>; DESC: CONN HEADER SMD 10POS 1.27MM; MANUFACTURER: Samtec; MPN: FTSH-105-01-L-DV-K; PARTNO: FTSH-105-01-L-DV-K; TYPE: Header
J4 = CommonSense-DTR-v1:SJ-43514-SMT: 4 conductor 3.5 mm Surface Mount Audio Jack; DESC: CONN JACK 4COND 3.5MM SMD R/A; HEIGHT: 5mm; MANUFACTURER: CUI Devices; MPN: SJ-43514-SMT; PARTNO: SJ-43514-SMT; TYPE: Audio Jack
J6 = CommonSense-DTR-v1:ATTINY_AVR_DEBUG: Cortex Debug Connector - 10 pin Supports JTAG debug, Serial Wire debug, and Serial Wire Viewer. PTH and SMD connector options available. General Connector Information <http://infocenter.arm.com/help/topic/com.arm.doc.faqs/attached/13634/cortex_debug_connectors.pdf> Products: PTH Connector <http://www.digikey.com/product-detail/en/cnc-tech/3220-10-0100-00/1175-1627-ND/3883661> -via Digi-Key SparkFun PSoc <https://www.sparkfun.com/products/13229> SparkFun T <https://www.sparkfun.com/products/13810>; DESC: CONN HEADER SMD 10POS 1.27MM; MANUFACTURER: Samtec; MPN: FTSH-105-01-L-DV-K; PARTNO: FTSH-105-01-L-DV-K; TYPE: Header
J7 = Connectors:J-USB-HIROSE-MICRO-USB: USB - Hirose ZX62D-AB-5P8(30) micro AB USB 2.0 Receptacle Connector 5 Position Surface Mount, Right Angle; Through Hole Because this component has through-hole tabs, it is much less susceptible to being ripped off of the board!; DESC: CONN RCPT USB2.0 MICRO AB SMD RA; MANUFACTURER: Hirose; MPN: ZX62D-AB-5P8(30); PARTNO: ZX62D-AB-5P8(30); TYPE: Receptor
JP1-JP6 JP12 JP13 JP15 = Connectors:JUMPER-SMT_2_NC_PASTE: Normally closed solder jumper This jumper has an aperture in the stencil to allow solder paste to bridge the split in the wire so it's normally closed (NC). Wick off the solder to open the connection. Reapply solder to reclose the connection.; BOM: EXCLUDE
JP14 = Connectors:JUMPER-SMT_2_NO_PASTEFREE: Normally open solder jumper This jumper has an aperture in the stencil to allow solder paste to bridge the split in the wire but it is normally open (NC). Apply solder to close the connection.; BOM: EXCLUDE; PARTNO: *
JP16 = Connectors:JUMPER-SMT_2_NO_PASTEFREE: Normally open solder jumper This jumper has an aperture in the stencil to allow solder paste to bridge the split in the wire but it is normally open (NC). Apply solder to close the connection.; BOM: EXCLUDE
MK1 = CommonSense-DTR-v1:SPW2430HR5H-B: Mic Mems Analog; AVAILABILITY: Unavailable; DESC: MAMET MIC ANALOG TOP PORT; DESCRIPTION: Mic Mems Analog; HEIGHT: 1.1mm; MANUFACTURER: Knowles; MF: Knowles; MP: SPW2430HR5H-B; MPN: SPW2430HR5H-B; OC_NEWARK: unknown; PACKAGE: Knowles; PARTNO: SPW2430HR5H-B; PRICE: None; SIZE: 0.122" L x 0.098" W (3.10mm x 2.50mm); TYPE: MEMS Microphone; VOLT: 1.5V ~ 3.6V
R1 = Resistors:R-: Resistor, Surface Mount; DESC: RES SMD 4.99KOHM 0.1% 1/16W 0402; HEIGHT: 0.4mm; MANUFACTURER: Panasonic; MPN: ERA-2AEB4991X; PARTNO: ERA-2AEB4991X; SIZE: 0402; TC: ±25ppm/°C; TOL: 0.1%; TYPE: Resistor
R2-R4 = Resistors:R-: Resistor, Surface Mount; DESC: RES SMD 100K OHM 0.1% 1/16W 0402; HEIGHT: 0.35mm; MANUFACTURER: Yageo; MPN: RT0402BRD07100KL; PARTNO: RT0402BRD07100KL; SIZE: 0402; TC: ±25ppm/°C; TOL: 0.1%; TYPE: Resistor
R5 R6 = Resistors:R-: Resistor, Surface Mount; DESC: RES SMD 4.7K OHM 1% 1/10W 0402; HEIGHT: 0.4mm; MANUFACTURER: Panasonic; MPN: ERJ2RKF4701X; PARTNO: ERJ2RKF4701X; SIZE: 0402; TC: ±100ppm/°C; TOL: 1%; TYPE: Resistor
R7 = Resistors:R-: Resistor, Surface Mount; DESC: RES SMD 50 OHM 0.1% 1/20W 0402; HEIGHT: 0.84mm; MANUFACTURER: Vishay; MPN: FC0402E50R0BST1; PARTNO: FC0402E50R0BST1; SIZE: 0402; TC: ±25ppm/°C; TOL: 0.1%; TYPE: Resistor
R8 = Resistors:R-: Resistor, Surface Mount; MANUFACTURER: Panasonic; MPN: RMCF0402ZT0R00; PARTNO: RMCF0402ZT0R00; TOL: 5%; TYPE: Resistor
R9 = Resistors:R-: Resistor, Surface Mount; DESC: RES SMD 39 OHM 1% 1/10W 0402; HEIGHT: 0.4mm; MANUFACTURER: Panasonic; MPN: ERJ-2RKF39R0X; PARTNO: ERJ-2RKF39R0X; SIZE: 0402; TC: ±100ppm/°C; TOL: 1%; TYPE: Resistor
R10 = Resistors:R-: Resistor, Surface Mount; DESC: RES SMD 100K OHM 1% 1/10W 0402; HEIGHT: 0.4mm; MANUFACTURER: Panasonic; MPN: ERJ-2RKF1003X; PARTNO: ERJ-2RKF1003X; SIZE: 0402; TC: ±100ppm/°C; TOL: 1%; TYPE: Resistor
R11 R12 = Resistors:R-: Resistor, Surface Mount; DESC: Thick Film Resistors - SMD 0402 1Kohms 1% AEC-Q200; MANUFACTURER: Panasonic; MPN: ERJ-2RKF1001X; PARTNO: ERJ-2RKF1001X; TOL: 1%; TYPE: Resistor
R27 R28 = CommonSense-DTR-v1:C0402-ANT: Capacitor, Surface Mount; BOM: EXCLUDE; DESC: RES 0 OHM JUMPER 1/16W 0402; MANUFACTURER: Stackpole; MPN: RMCF0402ZT0R00; PARTNO: RMCF0402ZT0R00; SIZE: 0402; TC: X7R; TOL: Jumper; TYPE: Resistor; VOLTAGE: 6.3V
R30 = Inductors:L0402; BOM: EXCLUDE; DESC: RES 0 OHM JUMPER 1/16W 0402; HEIGHT: 0.45mm; MANUFACTURER: Stackpole; MPN: RMCF0402ZT0R00; PARTNO: RMCF0402ZT0R00; SIZE: 0402; TOL: Jumper; TYPE: Resistor
R_SENSE = Resistors:R-: Resistor, Surface Mount; DESC: RES SMD 1.33 OHM 1% 1/16W 0402; HEIGHT: 0.4mm; MANUFACTURER: Vishay Dale; MPN: CRCW04021R33FKED; PARTNO: CRCW04021R33FKED; SIZE: 0402; TC: ±100ppm/°C; TOL: 1%; TYPE: Resistor
RED_LED = Diodes:LED: LED OSRAM: - CHIPLED LG R971, LG N971, LY N971, LG Q971, LY Q971, LO R971, LY R971 LH N974, LH R974 LS Q976, LO Q976, LY Q976 LO Q996 - Hyper CHIPLED LW Q18S LB Q993, LB Q99A, LB R99A - SideLED LS A670, LO A670, LY A670, LG A670, LP A670 LB A673, LV A673, LT A673, LW A673 LH A674 LY A675 LS A676, LA A676, LO A676, LY A676, LW A676 LS A679, LY A679, LG A679 - Hyper Micro SIDELED® LS Y876, LA Y876, LO Y876, LY Y876 LT Y87S - SmartLED LW L88C, LW L88S LB L89C, LB L89S, LG L890 LS L89K, LO L89K, LY L89K LS L896, LA L896, LO L896, LY L896 - TOPLED LS T670, LO T670, LY T670, LG T670, LP T670 LSG T670, LSP T670, LSY T670, LOP T670, LYG T670 LG T671, LOG T671, LSG T671 LB T673, LV T673, LT T673, LW T673 LH T674 LS T676, LA T676, LO T676, LY T676, LB T676, LH T676, LSB T676, LW T676 LB T67C, LV T67C, LT T67C, LS T67K, LO T67K, LY T67K, LW E67C LS E67B, LA E67B, LO E67B, LY E67B, LB E67C, LV E67C, LT E67C LW T67C LS T679, LY T679, LG T679 LS T770, LO T770, LY T770, LG T770, LP T770 LB T773, LV T773, LT T773, LW T773 LH T774 LS E675, LA E675, LY E675, LS T675 LS T776, LA T776, LO T776, LY T776, LB T776 LHGB T686 LT T68C, LB T68C - Hyper Mini TOPLED® LB M676 - Mini TOPLED Santana® LG M470 LS M47K, LO M47K, LY M47K Source: http://www.osram.convergy.de/; DESC: LED RED CLEAR CHIP SMD; MANUFACTURER: Kingbright; MPN: APT1608SURCK; PARTNO: APT1608SURCK; TYPE: LED
SJ3 = CommonSense-DTR-v1:JUMPER_SJ2W: SMD solder JUMPER; BOM: EXCLUDE
SW1 SW2 = CommonSense-DTR-v1:SPST_TACT: SMT 6mm switch, EVQQ2 series http://www.ladyada.net/library/eagle; DESC: SWITCH TACTILE SPST-NO 0.05A 32V; HEIGHT: 1.9mm; MANUFACTURER: C&K; MPN: KMR241NG ULC LFS; PARTNO: KMR241NG ULC LFS; SIZE: 4.60mm x 2.80mm; TYPE: Switch
U1 U7-U10 U14 = Switches:LOADSWITCH-MIC9416: Micrel 3A High-side Load Switch with Reverse Blocking http://ww1.microchip.com/downloads/en/DeviceDoc/MIC9416x.pdf https://www.digikey.com/product-detail/en/microchip-technology/MIC94162YCS-TR/576-4508-1-ND/4732487; DESC: IC PWR SWITCH P-CHAN 1:1 6WLCSP; HEIGHT: 0.65mm; MANUFACTURER: Microchip Technology; MPN: MIC94164YCS-TR; PARTNO: MIC94164YCS-TR; PART_NUMBER: MIC94164; QUENCH: YES; SIZE: 6-WLCSP (1x1.5); SOFTSTART: YES; TYPE: Power Switch
U2 = CommonSense-DTR-v1:ADA4841-1YRJZ-R7; DESC: IC OPAMP VFB 1 CIRCUIT SOT23-6; HEIGHT: 0.95-1.45mm; MANUFACTURER: Analog Devices; MANUFACTURER_PART_NUMBER: ADA48411YRJZR7; MPN: ADA48411YRJZR7; PARTNO: ADA48411YRJZR7; SIZE: SOT-23-6; SPICEMODEL: ADA4841; TYPE: Opamp; VENDOR: Analog Devices Inc
U3 U5 U6 = CommonSense-DTR-v1:TS3A24159DGSR; APPLICATION_BUILDNUMBER: *; COMPTYPE: IC; DESC: IC SWITCH SPDT DUAL 10VSSOP; HEIGHT: 1.1mm; MANUFACTURER: Texas Instruments; MOUNTTYPE: SMT; MPN: TS3A24159DGSR; PACKAGEREFERENCE: DGS0010A; PARTNO: TS3A24159DGSR; PARTNUMBER: TS3A24159DGSR; PIN_COUNT: 10; REFDES: RefDes; ROHS: Y; SIZE: 10-VSSOP; TYPE: SPDT Switch
U4 = Radios:RFM95: RFM95 - ISM Band LoRa Transceiver; DESC: RX TXRX MODULE ISM < 1GHZ SMD; FCC: 2ASEORFM95C; MANUFACTURER: HopeRF; MPN: RFM95CW; PARTNO: RFM95W; TYPE: Radio
U11 = CommonSense-DTR-v1:BMI160: BMI160 2.5 x 3 mm Tiaxial Accelerometer / Gyroscope Inertial Measurement Unit; AVAILABILITY: Unavailable; DESC: IMU ACCEL/GYRO I2C/SPI 14LGA; DESCRIPTION: Accelerometer, Gyroscope, 6 Axis Sensor I²C, SPI Output; DIGIKEY-PURCHASE-URL: https://snapeda.com/shop?store=DigiKey&id=104926; HEIGHT: 0.83mm; MANUFACTURER: Bosch; MF: Bosch; MP: BMI160; MPN: BMI160; PACKAGE: LGA-14 Bosch; PARTNO: BMI160; PRICE: None; SIZE: 14-LGA (2.5x3); TYPE: IMU
U13 = CommonSense-DTR-v1:ADG839YKSZ-500RL7; BUILT_BY: EMA_UL_Team; DESC: IC SWITCH SPDT SC70-6; HEIGHT: 0.9mm; MANUFACTURER_PART_NUMBER: ADG839YKSZ-500RL7; MPN: ADG839YKSZ-500RL7; PARTNO: ADG839YKSZ-500RL7; SIZE: SC-70-6; SOURCELIBRARY: Analog_2012-01-01_7; TYPE: SPDT Switch; VENDOR: Analog Devices Inc
U16 = CommonSense-DTR-v1:NCP553SQ18T1G; BUILT_BY: EMA_Jessica; COPYRIGHT: Copyright (C) 2016 Accelerated Designs. All rights reserved; DESC: IC REG LINEAR 1.8V 80MA SC82AB; HEIGHT: 0.8-1.1mm; MANUFACTURER: ON Semiconductor; MANUFACTURER_PART_NUMBER: NCP553SQ18T1G; MPN: NCP553SQ18T1G; PARTNO: NCP553SQ18T1G; SIZE: SC-82AB; SOURCELIBRARY: ON_Semiconductor_2018-03-21; TYPE: LDO; VENDOR: ON Semiconductor
U17 = CommonSense-DTR-v1:ATTINY817-MFRQFN24_RX4MC-L_ATTINY817-MFR; DESC: IC MCU 8BIT 8KB FLASH 24QFN; HEIGHT: 0.85mm; MANUFACTURER: Microchip; MANUFACTURER_PART_NUMBER: ATTINY817MFR; MPN: ATTINY817MFR; PARTNO: ATTINY817MFR; SIZE: 24-QFN (4x4); TYPE: MCU; VENDOR: Microchip
U19 = CommonSense-DTR-v1:MICROBUILDER_ATSAMD21J; DESC: IC MCU 32BIT 256KB FLASH 48QFN; HEIGHT: 0.85mm; MANUFACTURER: Microchip; MPN: ATSAMD21G18A-MF; PARTNO: ATSAMD21G18A-MF; SIZE: 48-QFN (7x7); TYPE: MCU
U206 = Sensors:MS5637: MS5637-02BA03 Low Voltage Barometric Pressure Sensor Specifications QFN package 3 x 3 x 0.9 mm3 High-resolution module, 13 cm Supply voltage: 1.5 to 3.6 V Fast conversion down to 0.5 ms Low power, 0.6 μA (standby ≤ 0.1 μA at 25°C) Integrated digital pressure sensor (24 bit ΔΣ ADC) Operating range: 300 to 1200 mbar, -40 to +85 °C I2C interface -- address 1110110x No external components (internal oscillator); MANUFACTURER: TE Connectivity; MPN: MS5637-02BA03
U$1 = CommonSense-DTR-v1:SGTL5000-QFN20; MPN: SGTL5000XNLA3R2; PARTNO: SGTL5000XNLA3R2
X1 = CommonSense-DTR-v1:ADAFRUIT2_XTAL: Low cost SMT crystals, no capacitors included http://www.ladyada.net/library/eagle; BOM: EXCLUDE; PARTNO: *
X2 = CommonSense-DTR-v1:ADAFRUIT2_XTAL: Low cost SMT crystals, no capacitors included http://www.ladyada.net/library/eagle; DESC: CRYSTAL 32.7680KHZ 6PF SMD; HEIGHT: 0.9mm; LOAD_CAPACITY: 6pF; MANUFACTURER: NDK; MPN: NX3215SA-32.768K-STD-MUA-14; PARTNO: NX3215SA-32.768K-STD-MUA-14; SIZE: 0.126" L x 0.059" W (3.20mm x 1.50mm); TOL: ±20ppm; TYPE: Crystal
X3 X5 X6 = Connectors:J-U.FL: U.FL Antenna Connector; DESC: CONN U.FL RCPT STR 50 OHM SMD; HEIGHT: 1.25mm; MANUFACTURER: Hirose; MPN: U.FL-R-SMT-1(01); PARTNO: U.FL-R-SMT-1(01); SIZE: 3.1 x 3mm; TYPE: Connector
X4 = Connectors:J-U.FL: U.FL Antenna Connector; DESC: CONN U.FL RCPT STR 50 OHM SMD; HEIGHT: 1.25mm; MEANUFACTURER: Hirose; MPN: U.FL-R-SMT-1(01); PARTNO: U.FL-R-SMT-1(01); SIZE: 3.1 x 3mm; TYPE: Connector

## Net classes
0 default: width 0.127 mm, drill 0.152 mm, clearance 0.127 mm
1 power: width 0.229 mm, drill 0.178 mm, clearance 0.127 mm
2 diff_pair: width 0.229 mm
3 12mil: width 0.305 mm, drill 0.33 mm
8 GND: width 0.127 mm